# EAGLE design Helm (EAGLE 7.1.0)
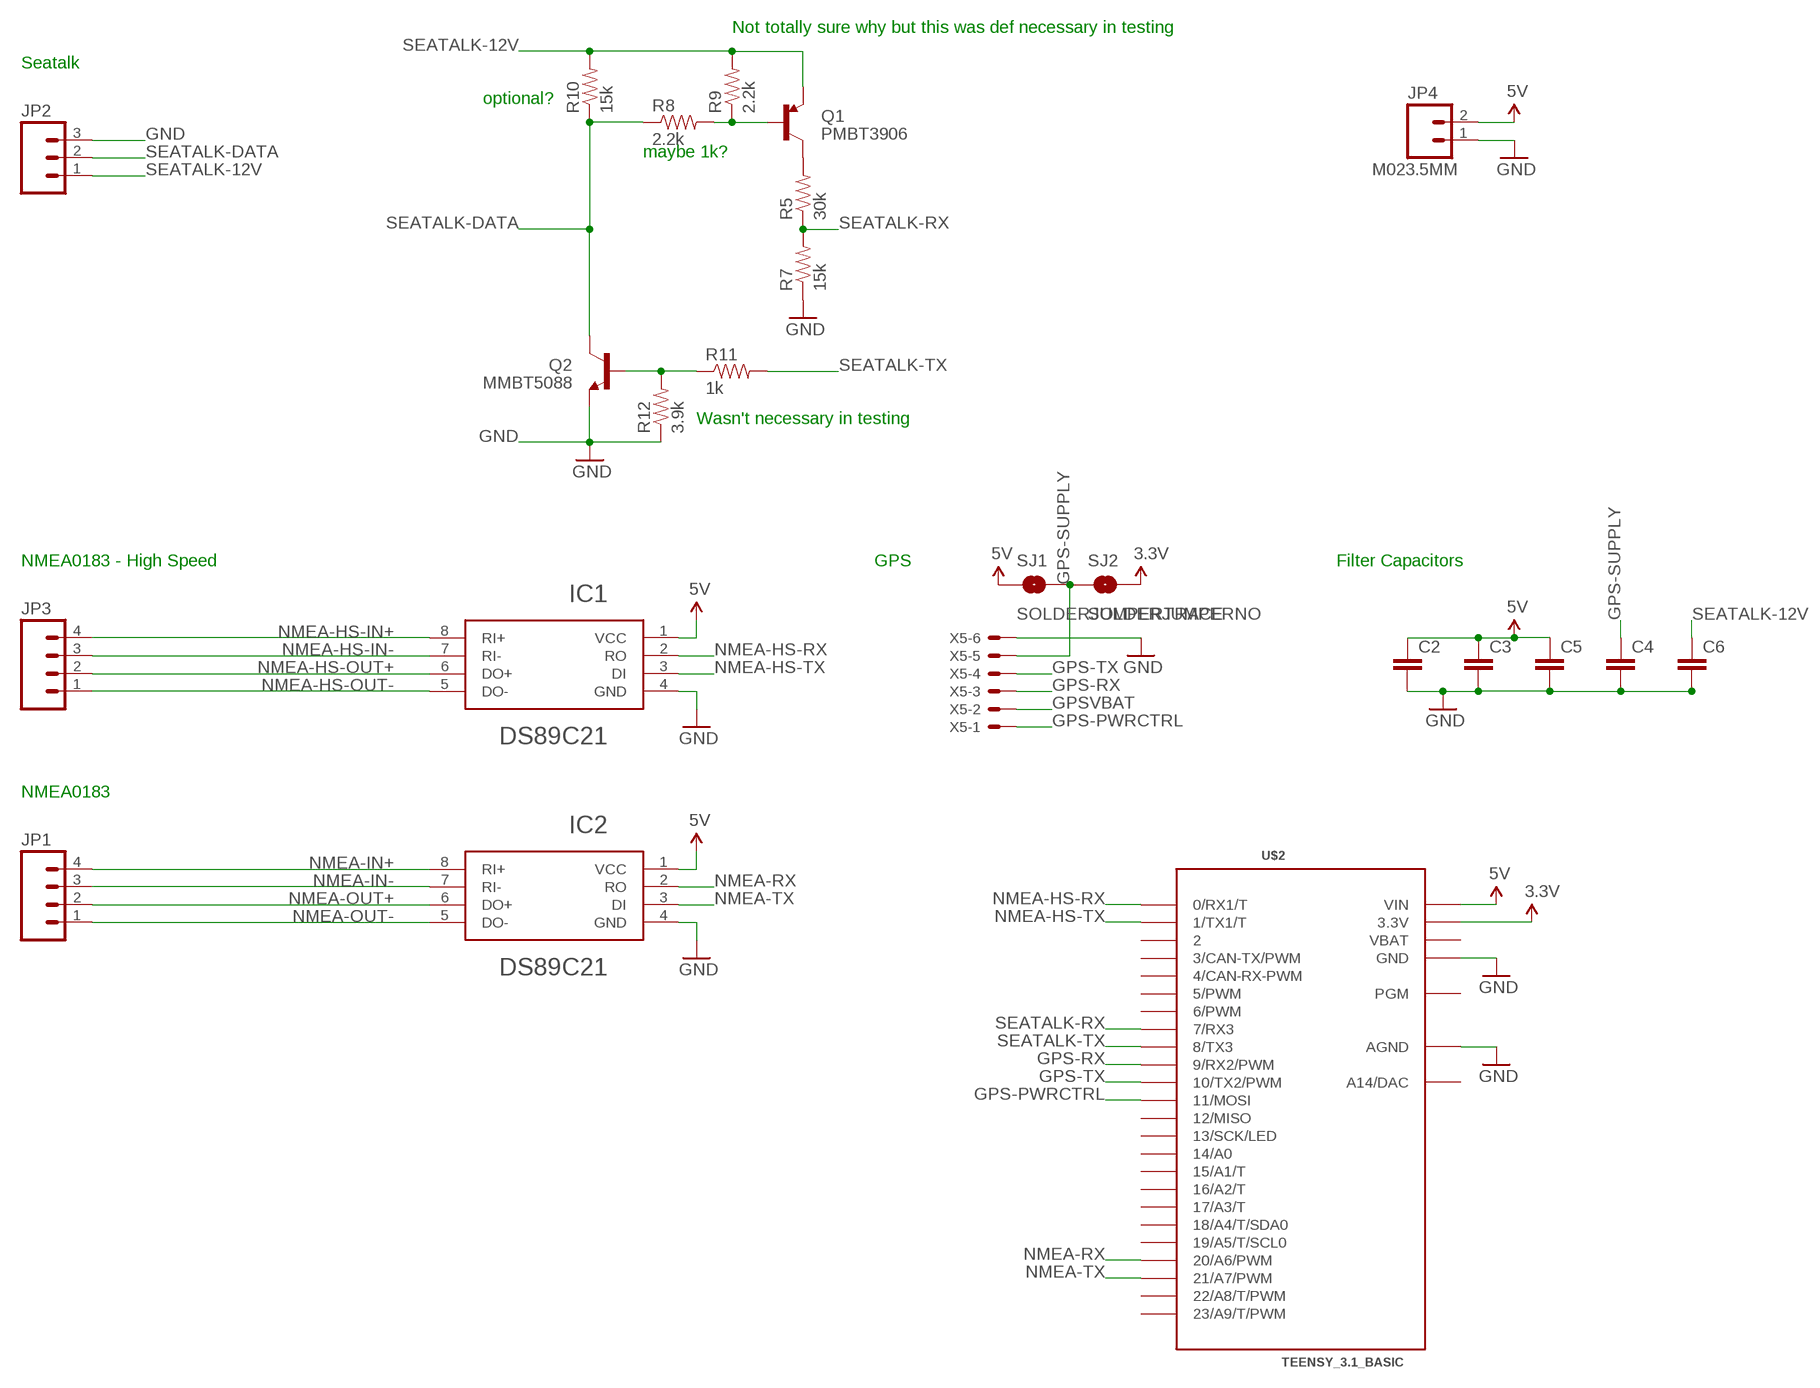
[diagram p0: schematic, sheet 1]

## Parts
C2  CAP0805  [0805]
C3  CAP0805  [0805]
C4  CAP0805  [0805]
C5  CAP0805  [0805]
C6  CAP0805  [0805]
IC1  DS89C21  [SO08]
IC2  DS89C21  [SO08]
JP1  M04SCREW  [SCREWTERMINAL-3.5MM-4]
JP2  M03SCREW  [SCREWTERMINAL-3.5MM-3]
JP3  M04SCREW  [SCREWTERMINAL-3.5MM-4]
JP4  M023.5MM  [SCREWTERMINAL-3.5MM-2]
Q1  PMBT3906  TRANSISTOR_PNPPMBT3906  [SOT23-3]
Q2  MMBT5088  TRANSISTOR_NPNMMBT5088  [SOT23-3]
R5  30k  RESISTOR0603-RES  [0603-RES]
R7  15k  RESISTOR0603-RES  [0603-RES]
R8  2.2k  RESISTOR0603-RES  [0603-RES]
R9  2.2k  RESISTOR0603-RES  [0603-RES]
R10  15k  RESISTOR0603-RES  [0603-RES]
R11  1k  RESISTOR0603-RES  [0603-RES]
R12  3.9k  RESISTOR0603-RES  [0603-RES]
SJ1  SOLDERJUMPERTRACE  [SJ_2S-TRACE]
SJ2  SOLDERJUMPERNO  [SJ_2S-NO]
U$2  TEENSY_3.1_BASIC  [TEENSY_3.1_BASIC]
X5  SM06B-SRSS-TB  [SM06B-SRSS-TB]

## Nets
3.3V: SJ2.2 U$2.3.3V U$2.3.3V1(3.3V)
5V [power]: C2.1 C3.1 C5.1 IC1.1(VCC) IC2.1(VCC) JP4.2 SJ1.1 U$2.VIN
GND: C2.2 C3.2 C4.2 C5.2 C6.2 IC1.4(GND) IC2.4(GND) JP2.3 JP4.1 Q2.2(E) R7.1 R12.1 U$2.AGND U$2.GND U$2.GND1(GND) X5.6
GPS-PWRCTRL: U$2.11(11/MOSI) X5.1
GPS-RX: U$2.9(9/RX2/PWM) X5.3
GPS-SUPPLY: C4.1 SJ1.2 SJ2.1 X5.5
GPS-TX: U$2.10(10/TX2/PWM) X5.4
GPSVBAT: X5.2
N$2: Q1.3(C) R5.2
N$3: Q1.1(B) R8.2 R9.1
N$9: Q2.1(B) R11.1 R12.2
NMEA-HS-IN+: IC1.8(RI+) JP3.4
NMEA-HS-IN-: IC1.7(RI-) JP3.3
NMEA-HS-OUT+: IC1.6(DO+) JP3.2
NMEA-HS-OUT-: IC1.5(DO-) JP3.1
NMEA-HS-RX: IC1.2(RO) U$2.0(0/RX1/T)
NMEA-HS-TX: IC1.3(DI) U$2.1(1/TX1/T)
NMEA-IN+: IC2.8(RI+) JP1.4
NMEA-IN-: IC2.7(RI-) JP1.3
NMEA-OUT+: IC2.6(DO+) JP1.2
NMEA-OUT-: IC2.5(DO-) JP1.1
NMEA-RX: IC2.2(RO) U$2.20/A6(20/A6/PWM)
NMEA-TX: IC2.3(DI) U$2.21/A7(21/A7/PWM)
SEATALK-12V: C6.1 JP2.1 Q1.2(E) R9.2 R10.2
SEATALK-DATA: JP2.2 Q2.3(C) R8.1 R10.1
SEATALK-RX: R5.1 R7.2 U$2.7(7/RX3)
SEATALK-TX: R11.2 U$2.8(8/TX3)
Unconnected: U$2.2 U$2.3(3/CAN-TX/PWM) U$2.4(4/CAN-RX-PWM) U$2.5(5/PWM) U$2.6(6/PWM) U$2.12(12/MISO) U$2.13(13/SCK/LED) U$2.14/A0 U$2.15/A1(15/A1/T) U$2.16/A2(16/A2/T) U$2.17/A3(17/A3/T) U$2.18/A4(18/A4/T/SDA0) U$2.19/A5(19/A5/T/SCL0) U$2.22/A8(22/A8/T/PWM) U$2.23/A9(23/A9/T/PWM) U$2.A14(A14/DAC) U$2.PGM

## Notes on the sheet
- Not totally sure why but this was def necessary in testing
- Seatalk
- optional?
- maybe 1k?
- Wasn't necessary in testing
- NMEA0183 - High Speed | GPS | Filter Capacitors
- NMEA0183

## Power pins joined to a net without a drawn wire
VBAT: U$2.VBAT

## Library data of the parts
C2-C6 = SparkFun-Capacitors:CAP: Capacitor Standard 0603 ceramic capacitor, and 0.1" leaded capacitor.
IC1 IC2 = Johnboiles:DS89C21: DS89C21 Differential CMOS Line Driver and Receiver Pair The DS89C21 is a differential CMOS line driver and receiver pair, designed to meet the requirements of TIA/EIA-422-A (RS-422) electrical characteristics interface standard. The DS89C21 provides one driver and one receiver in a minimum footprint. The device is offered in an 8-pin SOIC package.
JP1 JP3 = SparkFun-Connectors:M04: Header 4 Standard 4-pin 0.1" header. Use with straight break away headers (SKU : PRT-00116), right angle break away headers (PRT-00553), swiss pins (PRT-00743), machine pins (PRT-00117), and female headers (PRT-00115). Molex polarized connector foot print use with SKU : PRT-08231 with associated crimp pins and housings. 1MM SMD Version SKU: PRT-10208
JP2 = SparkFun-Connectors:M03: Header 3 Standard 3-pin 0.1" header. Use with straight break away headers (SKU : PRT-00116), right angle break away headers (PRT-00553), swiss pins (PRT-00743), machine pins (PRT-00117), and female headers (PRT-00115). Molex polarized connector foot print use with SKU : PRT-08232 with associated crimp pins and housings.
JP4 = SparkFun-Connectors:M02: Standard 2-pin 0.1" header. Use with - straight break away headers ( PRT-00116) - right angle break away headers (PRT-00553) - swiss pins (PRT-00743) - machine pins (PRT-00117) - female headers (PRT-00115) Molex polarized connector foot print use with: PRT-08233 with associated crimp pins and housings. 2.54_SCREWTERM for use with PRT-10571. 3.5mm Screw Terminal footprints for PRT-08084 5mm Screw Terminal footprints for use with PRT-08432
Q1 = SparkFun-DiscreteSemi:TRANSISTOR_PNP: Generic PNP BJT Double check pinouts against datasheets- not all devices are the same! MMBT3906 - 40V 200mA SOT-23 (TRANS-08052) MMBT4403 - 40V 600mA SOT-23 (TRANS-09245); PROD_ID: TRANS-08052
Q2 = SparkFun-DiscreteSemi:TRANSISTOR_NPN: Generic NPN BJT MMBT2222A - TRANS-08049 (SOT-23, 1A 40V) MPSA42 - TRANS-09116 (SOT-23, 500mA 300V) MMBT5088LT1G - TRANS-11160 (SOT-23, 50 mA 30V) BC547 - COM-08928 <http://www.sparkfun.com/products/8928> (TO-92 45V 100mA) (1.Collector 2.Base 3.Emitter) 2N3904 - COM-00521 <http://www.sparkfun.com/products/521> (TO-92 40V 200mA) (1.Emitter 2.Base 3.Collector) P2N2222A - COM-12852 <http://www.sparkfun.com/products/12852> (TO-92 40V 600mA) (1.Collector 2.Base 3.Emitter); PROD_ID: TRANS-11160
R5 R7-R12 = SparkFun-Passives:RESISTOR: Resistor Basic schematic elements and footprints for 0603, 1206, and PTH resistors.
SJ1 SJ2 = SparkFun-Retired:SOLDERJUMPER: Solder Jumper Standard SMD solder jumper. Used to automate production. Two varients : Normally Open and Normally Closed are the same, but have different paste layers. NC will have a large amount of paste and should jumper during reflow.
U$2 = Teensy_3_Series_Board_v1.0:TEENSY_3.1_BASIC: Footprint for Teensy 3.1 board using all pin connections on the outer perimeter
X5 = con-jst2:?M06B-SRSS-TB: Disconnectable Crimp style connector, 1.0mm pitch 6 contacts

## Net classes
1 power: width 0.254 mm

## Board
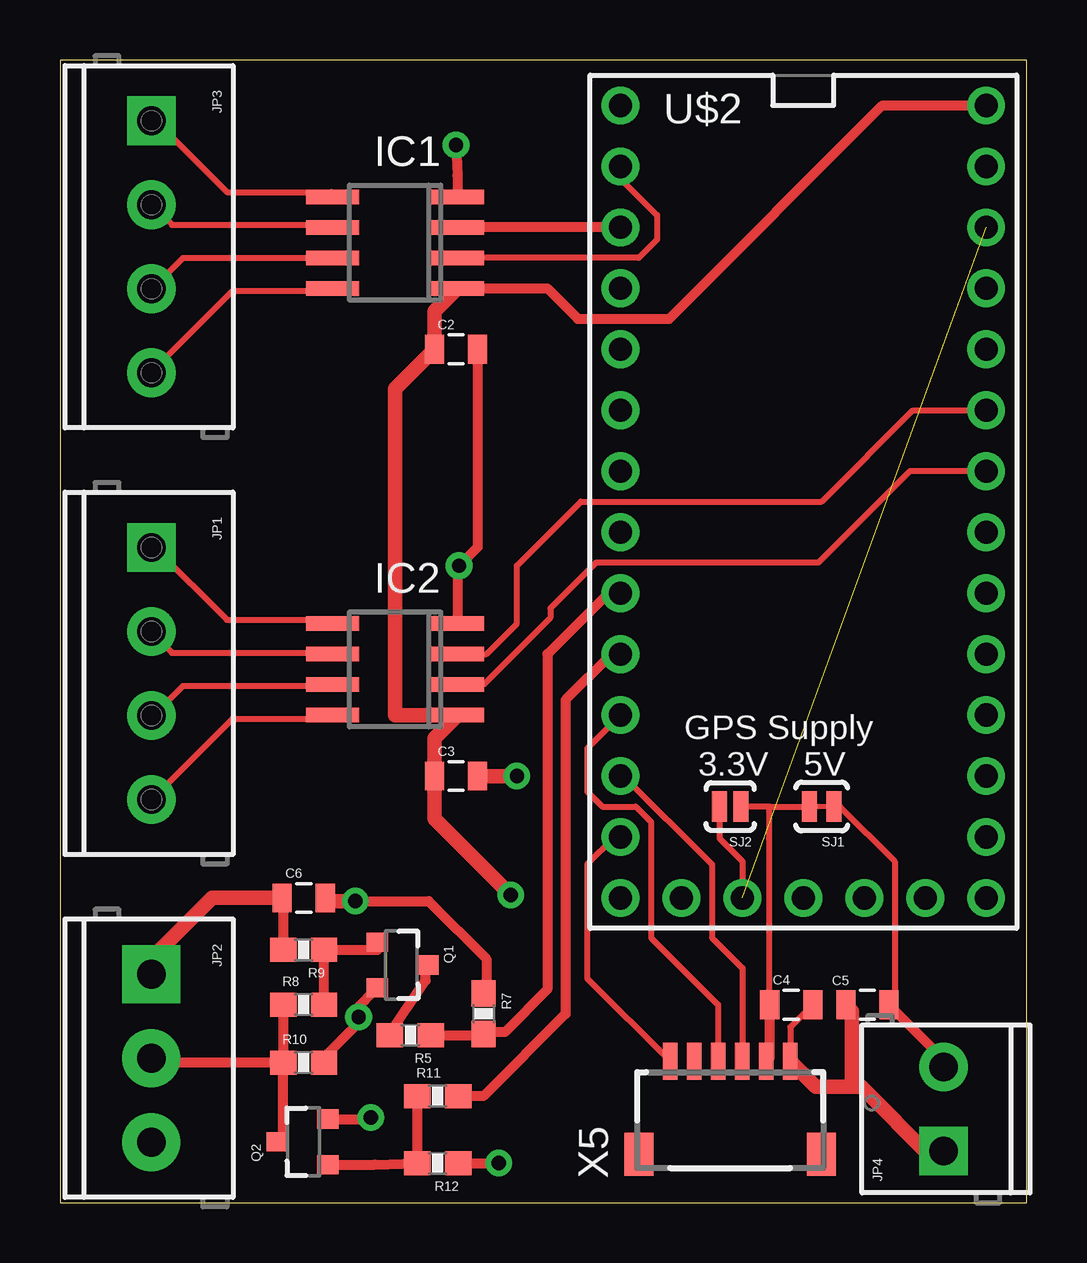
[diagram p1: board, top side]
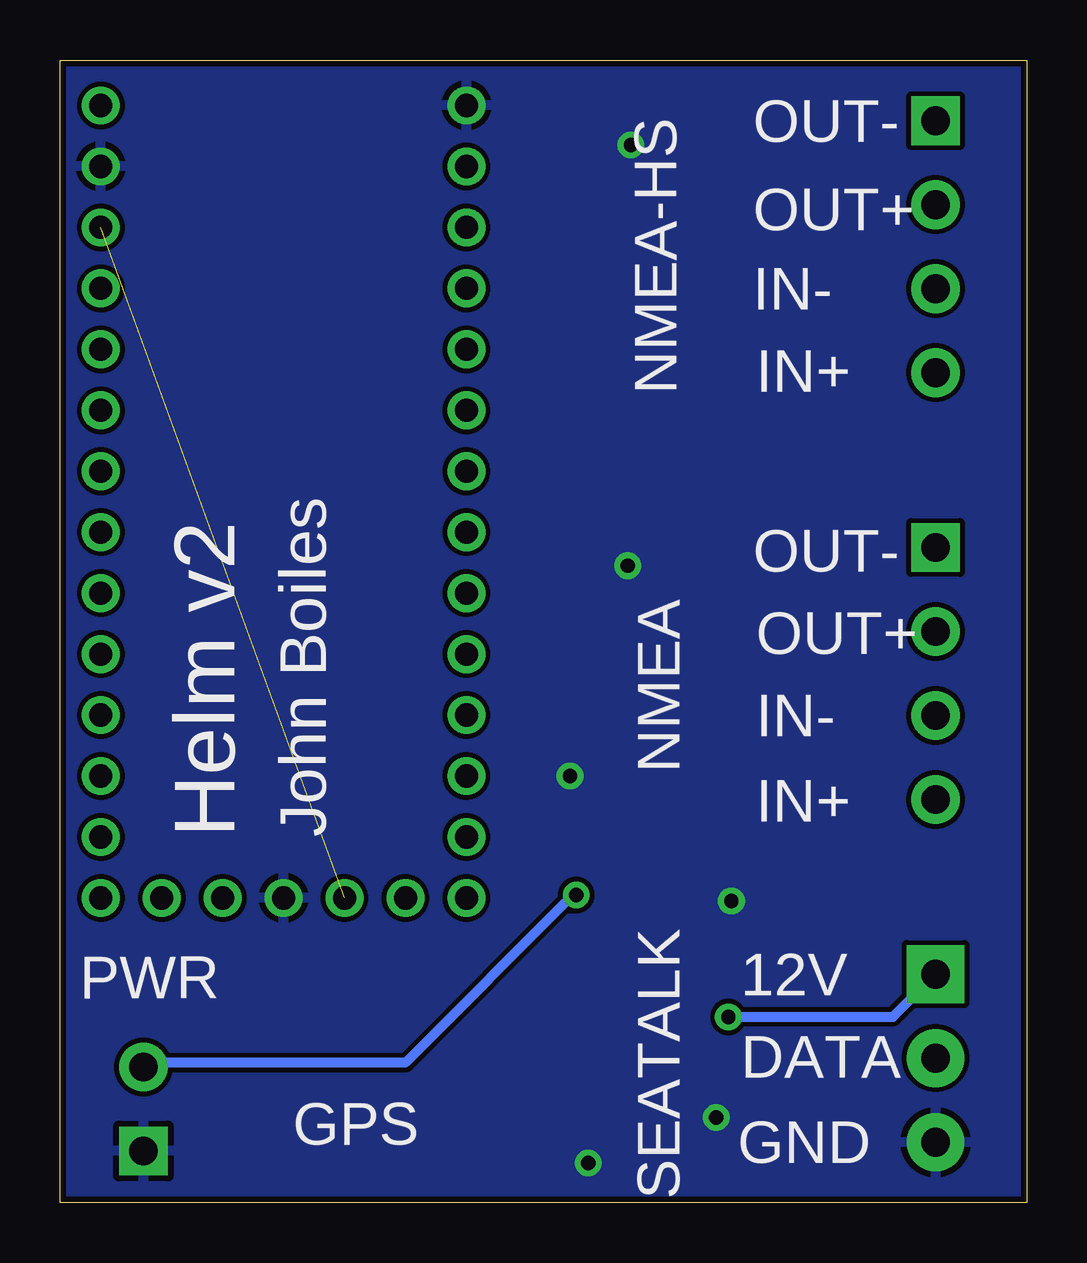
[diagram p2: board, bottom side, seen from below]

Size 40.31 x 47.62 mm. Coordinates in mm from the lower left corner, seen from the top.
Outline: 0,0 40.31,0 40.31,47.62 0,47.62 0,0
Copper layers (1*16): Top 0.035mm / dielectric 1.5mm / Bottom 0.035mm
Design rules "SparkFun": minimum track width 8mil, minimum drill 20mil, track to track 8mil, track to pad 8mil, pad to pad 8mil, via to via 8mil, smd to smd 8mil, copper to edge 10mil, drill to drill 8mil, minimum pad ring 12mil, minimum via ring 10mil, stop-mask expansion 4mil, vias tented up to drill 25mil, thermal gap 10mil

### Footprints (pad centres in the part's own frame; a part is rotated, then mirrored left to right if it is on the bottom)
0805 = smd 0.8 x 1.2: 1 -0.9,0; 2 0.9,0
SO08 = smd 0.6 x 2.2: 1 -1.905,-2.6; 2 -0.635,-2.6; 3 0.635,-2.6; 4 1.905,-2.6; 5 1.905,2.6; 6 0.635,2.6; 7 -0.635,2.6; 8 -1.905,2.6
SCREWTERMINAL-3.5MM-4 = drill 1.2 pad 2.032 square: 1 0,0 | drill 1.2 pad 2.032: 2 3.5,0; 3 7,0; 4 10.5,0
SCREWTERMINAL-3.5MM-3 = drill 1.2 pad 2.413 square: 1 0,0 | drill 1.2 pad 2.413: 2 3.5,0; 3 7,0
SCREWTERMINAL-3.5MM-2 = drill 1.2 pad 2.032 square: 1 0,0 | drill 1.2 pad 2.032: 2 3.5,0
SOT23-3 = smd 0.8 x 0.9: 1 -0.95,-1; 2 0.95,-1; 3 0,1.1
0603-RES = smd 1.1 x 1: 1 -0.85,0; 2 0.85,0
SJ_2S-TRACE = smd 0.635 x 1.27: 1 -0.508,0; 2 0.508,0
SJ_2S-NO = smd 0.635 x 1.27: 1 -0.45,0; 2 0.45,0
TEENSY_3.1_BASIC = drill 0.965: 0 -7.62,13.97; 1 -7.62,11.43; 2 -7.62,8.89; 3 -7.62,6.35; 3.3V 7.62,11.43; 3.3V1 -2.54,-16.51; 4 -7.62,3.81; 5 -7.62,1.27; 6 -7.62,-1.27; 7 -7.62,-3.81; 8 -7.62,-6.35; 9 -7.62,-8.89; 10 -7.62,-11.43; 11 -7.62,-13.97; 12 -7.62,-16.51; 13 7.62,-16.51; 14/A0 7.62,-13.97; 15/A1 7.62,-11.43; 16/A2 7.62,-8.89; 17/A3 7.62,-6.35; 18/A4 7.62,-3.81; 19/A5 7.62,-1.27; 20/A6 7.62,1.27; 21/A7 7.62,3.81; 22/A8 7.62,6.35; 23/A9 7.62,8.89; A14 5.08,-16.51; AGND 7.62,13.97; GND -7.62,16.51; GND1 0,-16.51; PGM 2.54,-16.51; VBAT -5.08,-16.51; VIN 7.62,16.51
SM06B-SRSS-TB = smd 0.6 x 1.55: 1 -2.5,2.975; 2 -1.5,2.975; 3 -0.5,2.975; 4 0.5,2.975; 5 1.5,2.975; 6 2.5,2.975 | smd 1.2 x 1.8: FIT@1 -3.8,-0.9; FIT@2 3.8,-0.9

### Placement (x,y rotation side)
C2  16.51,35.56 0 top
C3  16.51,17.78 0 top
C4  30.48,8.26 0 top
C5  33.66,8.26 180 top
C6  10.16,12.7 0 top
IC1  13.97,40.01 90 top
IC2  13.97,22.23 90 top
JP1  3.81,27.3 270 top
JP2  3.81,9.53 270 top
JP3  3.81,45.09 270 top
JP4  36.83,2.16 90 top
Q1  14.22,9.91 270 top
Q2  10.16,2.54 90 top
R5  14.61,6.99 180 top
R7  17.65,7.87 270 top
R8  10.16,8.26 0 top
R9  10.16,10.54 180 top
R10  10.16,5.84 0 top
R11  15.75,4.45 0 top
R12  15.75,1.65 180 top
SJ1  31.75,16.51 180 top
SJ2  27.94,16.51 180 top
U$2  30.99,29.21 0 top
X5  27.94,2.92 0 top

### Tracks (layer width: path | path; a pad name or v marks a point on that pad's centre or on a via)
3.3V  (1 unrouted)
  Top 0.254: SJ2.2 27.49,15.18 28.45,14.22 U$2.3.3V1
5V  (via drill 0.6)
  Top 0.254: SJ1.1 32.51,16.51 34.8,14.22 34.8,8.5 C5.1
  Top 0.406: IC1.1 20.32,38.1 21.59,36.83 25.4,36.83 34.29,45.72 U$2.VIN | JP4.2 36.83,5.98 C5.1 | 18.71,12.91 v18.8,12.83
  Top 0.61: IC1.1 15.61,37.14 C2.1 13.97,33.92 13.97,20.32 IC2.1 15.61,19.36 C3.1 15.62,17.77 15.62,16 18.71,12.91
  Bottom 0.406: v18.8,12.83 18.92,12.83 25.91,5.84 36.32,5.84 36.65,6.17 36.65,5.84 JP4.2
GND  (via drill 0.6)
  Top 0.254: X5.6 30.44,7.32 C4.2
  Top 0.406: IC2.4 16.57,26.29 v16.64,26.54 17.41,27.32 C2.2 | v16.51,44.07 16.57,42.8 IC1.4 | Q2.2 12.95,3.49 v12.95,3.56 | v12.32,12.57 15.37,12.57 17.78,10.16 17.78,8.85 R7.1 | R12.1 v18.29,1.65
  Top 0.61: X5.6 31.51,4.83 33.02,4.83 | 33.02,4.83 33.4,4.83 36.32,1.91 JP4.1 | C5.2 33.02,7.99 33.02,4.83 | C3.2 v19.05,17.78 | C6.2 11.19,12.57 v12.32,12.57
  pour Bottom: 0.38,0.38 39.88,0.38 40.01,47.24 0.38,47.24
GPS-PWRCTRL
  Top 0.254: U$2.11 23.11,15.24 21.97,14.1 21.97,9.37 X5.1
GPS-RX
  Top 0.254: U$2.9 21.97,18.92 21.97,17.14 22.61,16.51 24,16.51 24.64,15.88 24.64,11.05 27.43,8.26 X5.3
GPS-SUPPLY
  Top 0.254: C4.1 29.58,16.5 29.59,16.51 | 29.59,16.51 SJ2.1 | 29.59,16.51 SJ1.2
  Top 0.406: C4.1 29.58,6.04 X5.5
GPS-TX
  Top 0.254: U$2.10 23.5,17.78 27.18,14.1 27.18,11.05 28.45,9.78 X5.4
N$2
  Top 0.406: R5.2 13.63,6.9 15.24,9.27 15.24,9.82 Q1.3
N$3
  Top 0.406: Q1.1 13.22,10.54 R9.1 R8.2
N$9
  Top 0.406: Q2.1 13.12,1.59 R12.2 R11.1
NMEA-HS-IN+
  Top 0.254: IC1.8 11.3,38 7.19,38 3.99,34.8 JP3.4
NMEA-HS-IN-
  Top 0.254: IC1.7 5.13,39.37 3.99,38.23 JP3.3
NMEA-HS-OUT+
  Top 0.254: IC1.6 11.3,40.74 4.67,40.74 3.99,41.43 JP3.2
NMEA-HS-OUT-
  Top 0.254: IC1.5 11.3,42.11 6.96,42.11 3.99,45.09 JP3.1
NMEA-HS-RX
  Top 0.254: U$2.0 23.37,42.67 24.89,41.15 24.89,40.13 24.13,39.37 IC1.2
NMEA-HS-TX
  Top 0.406: U$2.1 IC1.3
NMEA-IN+
  Top 0.254: IC2.8 11.3,20.17 7.19,20.17 3.99,16.97 JP1.4
NMEA-IN-
  Top 0.254: IC2.7 11.3,21.54 5.13,21.54 3.99,20.4 JP1.3
NMEA-OUT+
  Top 0.254: IC2.6 11.3,22.91 4.67,22.91 3.99,23.6 JP1.2
NMEA-OUT-
  Top 0.254: IC2.5 11.3,24.28 6.96,24.28 3.99,27.25 JP1.1
NMEA-RX
  Top 0.254: U$2.20/A6 35.43,30.48 31.62,26.67 22.35,26.67 20.45,24.77 20.45,24.38 17.65,21.59 IC2.2
NMEA-TX
  Top 0.254: IC2.3 17.78,22.86 19.05,24.13 19.05,26.54 21.72,29.21 31.75,29.21 35.56,33.02 U$2.21/A7
SEATALK-12V  (via drill 0.6)
  Top 0.406: C6.1 9.31,12.7 R9.2 | R10.2 11.01,6.06 12.32,7.37 12.32,7.62 | 12.32,7.62 12.32,8.05 Q1.2 | v12.45,7.75 12.32,7.62
  Top 0.61: C6.1 6.35,12.7 3.81,10.16 JP2.1
  Bottom 0.406: v12.45,7.75 5.59,7.75 JP2.1
SEATALK-DATA
  Top 0.406: R8.1 R10.1 | 8.89,2.54 Q2.3 9.31,2.54 R10.1 | R10.1 3.99,5.84 JP2.2
SEATALK-RX
  Top 0.406: R5.1 17.65,6.99 R7.2 17.74,7.11 18.54,7.11 20.32,8.89 20.32,22.86 22.86,25.4 U$2.7
SEATALK-TX
  Top 0.406: U$2.8 22.99,22.86 21.08,20.95 21.08,7.87 17.65,4.45 R11.2

### Text on the board
tNames: GPS Supply | 3.3V | 5V
bNames: NMEA-HS | OUT- | OUT+ | IN- | IN+ | OUT- | NMEA | OUT+ | IN- | IN+ | John Boiles | Helm v2 | SEATALK | 12V | PWR | DATA | GND | GPS
bDocu: + | -